# Altium schematic sheet STM89C52.SchDoc
size A4
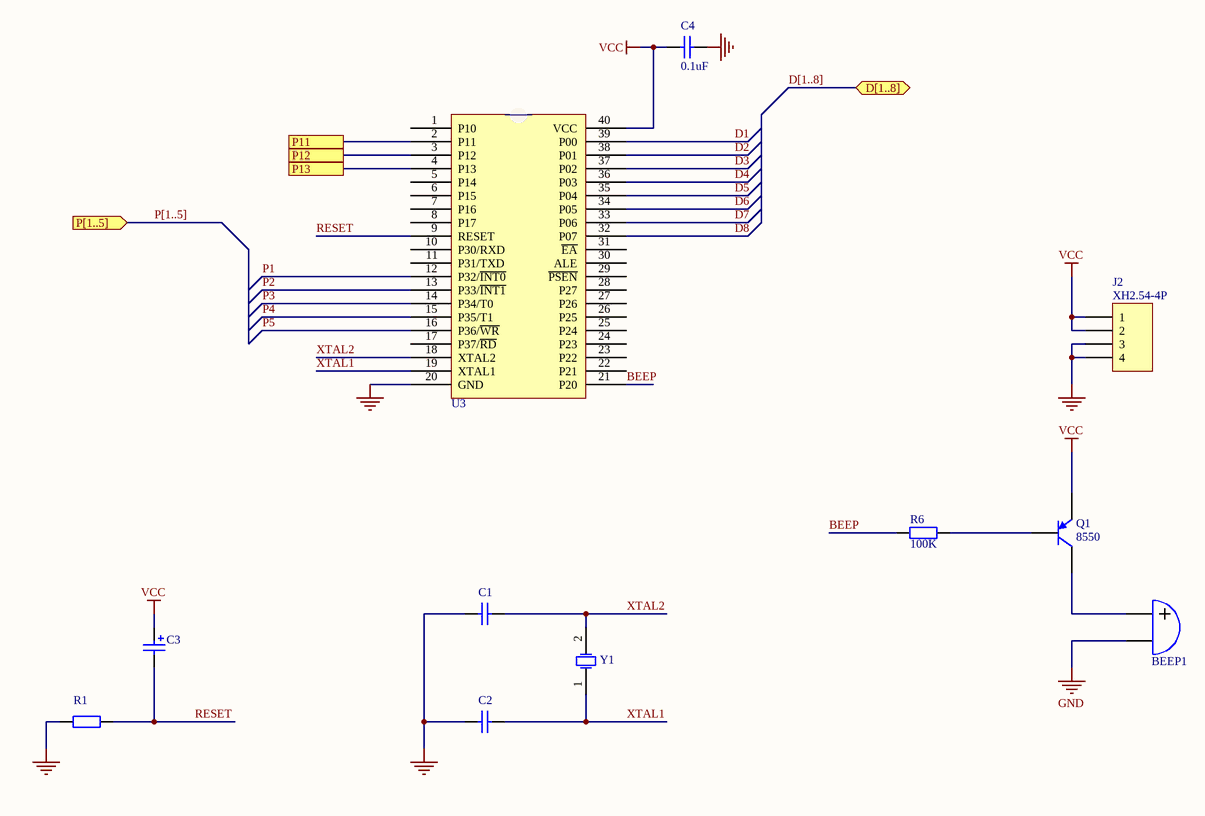
[diagram p0: STM89C52.SchDoc]

## Parts
BEEP1  BEEP  [BEEP]  (value not drawn)
C1  Cap  [RAD-0.2]  (value not drawn)
C2  Cap  [RAD-0.2]  (value not drawn)
C3  Cap Pol1  [RB7.6-15]  (value not drawn)
C4  value 0.1uF  [RAD-0.2]  (hidden comment: Cap)
J2  XH2.54-4P  [HDR1X4]
Q1  8550  [PNP]
R1  10K  [AXIAL-0.4]  (value not drawn)
R6  100K  [RES]
U3  STC89C52  [DIP40]  (value not drawn)
Y1  12MHZ  [XT12M]  (value not drawn)

## Ports
D[1..8] (bidir), P11, P12, P13, P[1..5] (in)

## Nets
GND: BEEP1.2 C1.2 C2.2 C4.1 J2.3 J2.4 R1.1 U3.20(GND)
VCC: C3.1 C4.2 J2.1 J2.2 Q1.1(E) U3.40(VCC)
BEEP: R6.1 U3.21(P20)
D1: U3.39(P00)
D2: U3.38(P01)
D3: U3.37(P02)
D4: U3.36(P03)
D5: U3.35(P04)
D6: U3.34(P05)
D7: U3.33(P06)
D8: U3.32(P07)
P1: U3.12(P32/~{INT0})
P2: U3.13(P33/~{INT1})
P3: U3.14(P34/T0)
P4: U3.15(P35/T1)
P5: U3.16(P36/~{WR})
P11: U3.2(P11) ; port P11
P12: U3.3(P12) ; port P12
P13: U3.4(P13) ; port P13
RESET: C3.2 R1.2 U3.9(RESET)
XTAL1: C2.1 U3.19(XTAL1) Y1.1(OSC1)
XTAL2: C1.1 U3.18(XTAL2) Y1.2(OSC2)
NetBEEP1_1: BEEP1.1 Q1.3(C)
NetQ1_2: Q1.2(B) R6.2

Not connected (* = marked no-connect by the designer): U3 1(P10) 5(P14) 6(P15) 7(P16) 8(P17) 10(P30/RXD) 11(P31/TXD) 17(P37/~{RD}) 22(P21) 23(P22) 24(P23) 25(P24) 26(P25) 27(P26) 28(P27) 29(~{PSEN}) 30(ALE) 31(~{EA})

## Buses and harness runs
bus D[1..8] = port D[1..8]
bus P[1..5] = port P[1..5]

## Library data of the parts
C1 C2 = Cap: Capacitor; value: 0.1uF; Published: 8-Jun-2000; LatestRevisionDate: 17-Jul-2002; LatestRevisionNote: Re-released for DXP Platform.; PackageReference: RAD-0.3; Publisher: Altium Limited
C3 = Cap Pol1: Polarized Capacitor (Radial); Value: 100uF; Published: 8-Jun-2000; LatestRevisionDate: 17-Jul-2002; LatestRevisionNote: Re-released for DXP Platform.; PackageReference: RB7.6-15; Publisher: Altium Limited
C4 = Cap: Capacitor; Published: 8-Jun-2000; LatestRevisionDate: 17-Jul-2002; LatestRevisionNote: Re-released for DXP Platform.; PackageReference: RAD-0.3; Publisher: Altium Limited
J2 = Header 4: Header, 4-Pin; LatestRevisionDate: 17-Jul-2002; LatestRevisionNote: Re-released for DXP Platform.; Publisher: Altium Limited
Q1 = PNP
R1 = Res2: Resistor; Published: 8-Jun-2000; LatestRevisionDate: 17-Jul-2002; LatestRevisionNote: Re-released for DXP Platform.; PackageReference: AXIAL-0.4; Publisher: Altium Limited; PackageDescription: Axial Device, Thru-Hole; 2 Leads; 0.4 in Pin Spacing; Value: 10K
R6 = Res
Y1 = XTAL: Crystal Oscillator; Published: 8-Jun-2000; LatestRevisionDate: 17-Jul-2002; LatestRevisionNote: Re-released for DXP Platform.; PackageReference: R38; Publisher: Altium Limited; PackageDescription: Crystal, Thru-Hole; 2 Leads; Body 3.1 x 8.2 mm (Dia.xH)